# Altium project Project.PrjPcb
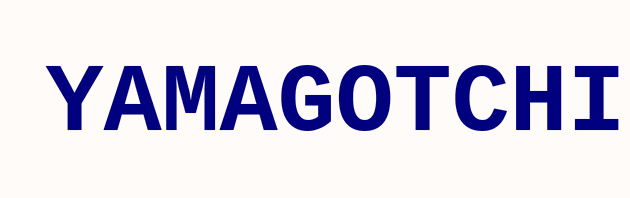
[diagram p0: p01_main.SchDoc]
9 sheets, 87 parts. Net scope: global (net labels, ports and power ports of the same name join across sheets).
Board file: board.PcbDoc
Sheets:
  p01_main.SchDoc
  p02_power.SchDoc
  p03_display.SchDoc
  p04_buttons.SchDoc
  p05_leds.SchDoc
  p06_sound.SchDoc
  p07_cpu_renesas_144.SchDoc
  p08_boot.SchDoc
  p09_memory.SchDoc

## Sheet p01_main.SchDoc
size A4

### Notes on the sheet
- YAMAGOTCHI

## Sheet p02_power.SchDoc
size A
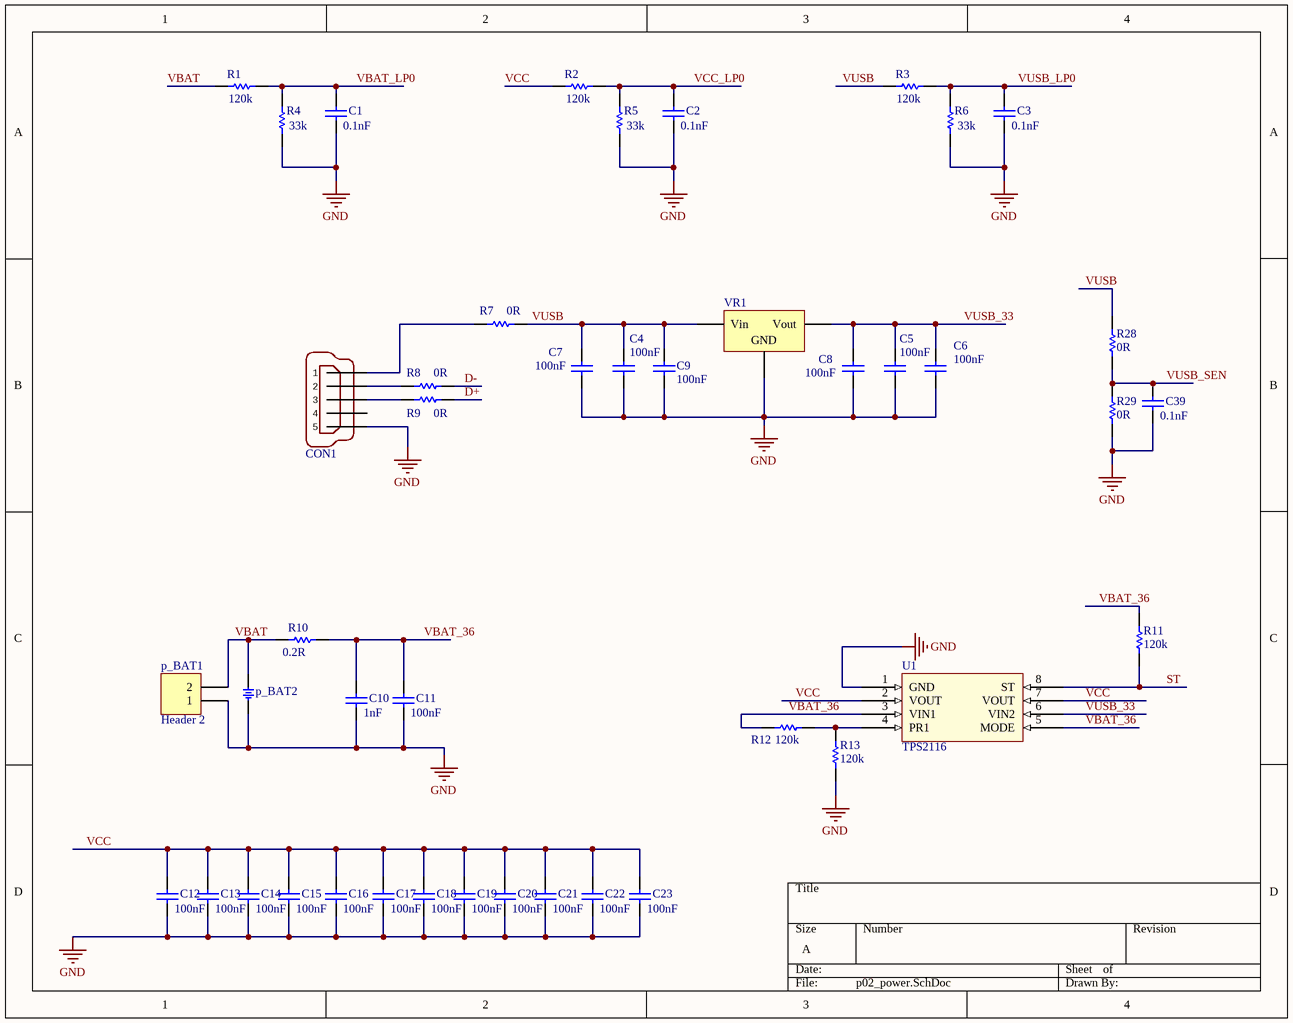
[diagram p1: p02_power.SchDoc]

### Parts
C1  value 0.1nF  [C0805]  (hidden comment: Cap)
C2  value 0.1nF  [C0805]  (hidden comment: Cap)
C3  value 0.1nF  [C0805]  (hidden comment: Cap)
C4  value 100nF  [C0805]  (hidden comment: Cap)
C5  value 100nF  [C0805]  (hidden comment: Cap)
C6  value 100nF  [C0805]  (hidden comment: Cap)
C7  value 100nF  [C0805]  (hidden comment: Cap)
C8  value 100nF  [C0805]  (hidden comment: Cap)
C9  value 100nF  [C0805]  (hidden comment: Cap)
C10  value 1nF  [C0805]  (hidden comment: Cap)
C11  value 100nF  [C0805]  (hidden comment: Cap)
C12  value 100nF  [C0805]  (hidden comment: Cap)
C13  value 100nF  [C0805]  (hidden comment: Cap)
C14  value 100nF  [C0805]  (hidden comment: Cap)
C15  value 100nF  [C0805]  (hidden comment: Cap)
C16  value 100nF  [C0805]  (hidden comment: Cap)
C17  value 100nF  [C0805]  (hidden comment: Cap)
C18  value 100nF  [C0805]  (hidden comment: Cap)
C19  value 100nF  [C0805]  (hidden comment: Cap)
C20  value 100nF  [C0805]  (hidden comment: Cap)
C21  value 100nF  [C0805]  (hidden comment: Cap)
C22  value 100nF  [C0805]  (hidden comment: Cap)
C23  value 100nF  [C0805]  (hidden comment: Cap)
C39  value 0.1nF  [C0805]  (hidden comment: Cap)
CON1  897-43-005-00-100001  [USB-MINI-B-5P-SMD]  (value not drawn)
p_BAT1  Header 2  [HDR1X2]
p_BAT2  (no value)  [BTH2032]
R1  value 120k  [6-0805_M]  (hidden comment: Res1)
R2  value 120k  [6-0805_M]  (hidden comment: Res1)
R3  value 120k  [6-0805_M]  (hidden comment: Res1)
R4  value 33k  [6-0805_M]  (hidden comment: Res1)
R5  value 33k  [6-0805_M]  (hidden comment: Res1)
R6  value 33k  [6-0805_M]  (hidden comment: Res1)
R7  0R  [6-0805_M]
R8  0R  [6-0805_M]
R9  0R  [6-0805_M]
R10  value 0.2R  [6-0805_M]  (hidden comment: Res1)
R11  value 120k  [6-0805_M]  (hidden comment: Res1)
R12  value 120k  [6-0805_M]  (hidden comment: Res1)
R13  value 120k  [6-0805_M]  (hidden comment: Res1)
R28  0R  [6-0805_M]
R29  0R  [6-0805_M]
U1  TPS2116  [SOIC127P600X175-8N]
VR1  Volt Reg  [D2PAK_N]  (value not drawn)

### Nets
GND: C1.2 C2.2 C3.2 C4.1 C5.1 C6.1 C7.1 C8.1 C9.1 C10.1 C11.1 C12.1 C13.1 C14.1 C15.1 C16.1 C17.1 C18.1 C19.1 C20.1 C21.1 C22.1 C23.1 C39.2 CON1.5 p_BAT1.1 p_BAT2.2 R4.2 R5.2 R6.2 R13.2 R29.2 U1.1(GND) VR1.2(GND)
D+: R9.1
D-: R8.1
ST: R11.2 U1.8(ST)
VBAT: p_BAT1.2 p_BAT2.1 R1.2 R10.2
VBAT_36: C10.2 C11.2 R10.1 R11.1 R12.1 U1.3(VIN1) U1.5(MODE)
VBAT_LP0: C1.1 R1.1 R4.1
VCC: C12.2 C13.2 C14.2 C15.2 C16.2 C17.2 C18.2 C19.2 C20.2 C21.2 C22.2 C23.2 R2.2 U1.2(VOUT) U1.7(VOUT)
VCC_LP0: C2.1 R2.1 R5.1
VUSB: C4.2 C7.2 C9.2 R3.2 R7.1 R28.1 VR1.1(Vin)
VUSB_33: C5.2 C6.2 C8.2 U1.6(VIN2) VR1.3(Vout)
VUSB_LP0: C3.1 R3.1 R6.1
VUSB_SEN: C39.1 R28.2 R29.1
NetCON1_1: CON1.1 R7.2
NetCON1_2: CON1.2 R8.2
NetCON1_3: CON1.3 R9.2
NetR12_2: R12.2 R13.1 U1.4(PR1)

Not connected (* = marked no-connect by the designer): CON1 4

### Library data of the parts
C1-C23 C39 = Cap: Capacitor; Published: 8-Jun-2000; LatestRevisionDate: 17-Jul-2002; LatestRevisionNote: Re-released for DXP Platform.; PackageReference: RAD-0.3; Publisher: Altium Limited; PackageDescription: Radial Cap, Thru-Hole; 2 Leads; 0.3 in Pin Spacing
CON1 = MINI-USB-32005-201: Connector,MiniUSB B port,5 position,Right Angle,Gold flash 30u,black,SMD; Manufacturer: MILL-MAX; Embest PN: 1009007100067; Value: 897-43-005-00-100001; Part Type: USB Connector; Manufacturer Part Number: 897-43-005-00-100001
p_BAT1 = Header 2: Header, 2-Pin; LatestRevisionDate: 17-Jul-2002; LatestRevisionNote: Re-released for DXP Platform.; Publisher: Altium Limited
p_BAT2 = BATH_CR2032: BATTERY HOLDER, CR2032; MANF_P#: -; .: http://www.chila.ir
R1-R6 R10-R13 = Res1: Resistor; Published: 8-Jun-2000; LatestRevisionDate: 17-Jul-2002; LatestRevisionNote: Re-released for DXP Platform.; PackageReference: AXIAL-0.3; Publisher: Altium Limited; PackageDescription: Axial Device, Thru-Hole; 2 Leads; 0.3 in Pin Spacing
R7-R9 R28 R29 = Res1: Resistor; Value: 0.2R; Published: 8-Jun-2000; LatestRevisionDate: 17-Jul-2002; LatestRevisionNote: Re-released for DXP Platform.; PackageReference: AXIAL-0.3; Publisher: Altium Limited; PackageDescription: Axial Device, Thru-Hole; 2 Leads; 0.3 in Pin Spacing
U1 = TPS2116: TPS2116 1.6 V to 5.5 V, 2.5-A Low IQ Power Mux with Manual and Priority Switchover
VR1 = Volt Reg: Voltage Regulator; Published: 24-Mar-1999; LatestRevisionDate: 29-May-2009; LatestRevisionNote: IPC-7351 Footprint Added.; PackageReference: D2PAK; Publisher: Altium Limited; PackageDescription: 3-Pin Transistor Outline Package 2.54 mm Pitch, 15.1 mm Lead Span

## Sheet p03_display.SchDoc
size A
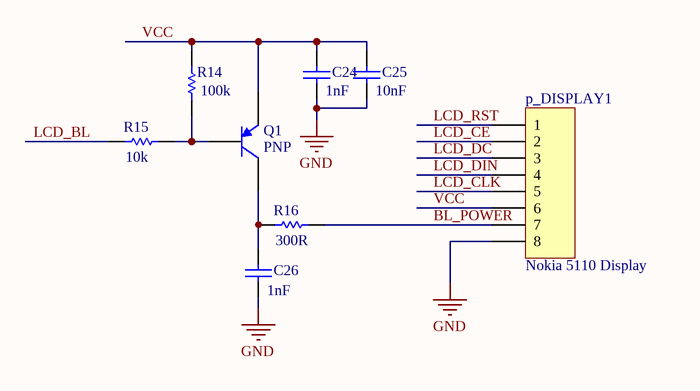
[diagram p2: p03_display.SchDoc]

### Parts
C24  value 1nF  [C0805]  (hidden comment: Cap)
C25  value 10nF  [C0805]  (hidden comment: Cap)
C26  value 1nF  [C0805]  (hidden comment: Cap)
p_DISPLAY1  Nokia 5110 Display  [HDR1X8]
Q1  PNP  [SOT-23B_N]
R14  value 100k  [6-0805_M]  (hidden comment: Res1)
R15  value 10k  [6-0805_M]  (hidden comment: Res1)
R16  value 300R  [6-0805_M]  (hidden comment: Res1)

### Nets
GND: C24.1 C25.1 C26.1 p_DISPLAY1.8
BL_POWER: p_DISPLAY1.7 R16.1
LCD_BL: R15.2
LCD_CE: p_DISPLAY1.2
LCD_CLK: p_DISPLAY1.5
LCD_DC: p_DISPLAY1.3
LCD_DIN: p_DISPLAY1.4
LCD_RST: p_DISPLAY1.1
VCC: C24.2 C25.2 p_DISPLAY1.6 Q1.3(E) R14.1
NetC26_2: C26.2 Q1.1(C) R16.2
NetQ1_2: Q1.2(B) R14.2 R15.1

### Library data of the parts
C24-C26 = Cap: Capacitor; Published: 8-Jun-2000; LatestRevisionDate: 17-Jul-2002; LatestRevisionNote: Re-released for DXP Platform.; PackageReference: RAD-0.3; Publisher: Altium Limited; PackageDescription: Radial Cap, Thru-Hole; 2 Leads; 0.3 in Pin Spacing
p_DISPLAY1 = Header 8: Header, 8-Pin; LatestRevisionDate: 17-Jul-2002; LatestRevisionNote: Re-released for DXP Platform.; Publisher: Altium Limited
Q1 = PNP: PNP Bipolar Transistor; Published: 8-Jun-2000; LatestRevisionDate: 29-May-2009; LatestRevisionNote: IPC-7351 Footprint Added.; PackageVersion: Aug-1999; PackageReference: SOT-23B; Publisher: Altium Limited; PackageDescription: 3-Pin SOT-23 Package 0.95 mm Pitch, 2.4 mm Lead Span
R14-R16 = Res1: Resistor; Published: 8-Jun-2000; LatestRevisionDate: 17-Jul-2002; LatestRevisionNote: Re-released for DXP Platform.; PackageReference: AXIAL-0.3; Publisher: Altium Limited; PackageDescription: Axial Device, Thru-Hole; 2 Leads; 0.3 in Pin Spacing

## Sheet p04_buttons.SchDoc
size A
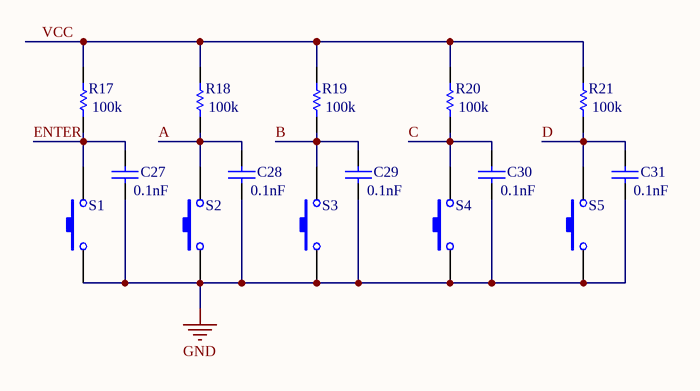
[diagram p3: p04_buttons.SchDoc]

### Parts
C27  value 0.1nF  [C0805]  (hidden comment: Cap)
C28  value 0.1nF  [C0805]  (hidden comment: Cap)
C29  value 0.1nF  [C0805]  (hidden comment: Cap)
C30  value 0.1nF  [C0805]  (hidden comment: Cap)
C31  value 0.1nF  [C0805]  (hidden comment: Cap)
R17  value 100k  [6-0805_M]  (hidden comment: Res1)
R18  value 100k  [6-0805_M]  (hidden comment: Res1)
R19  value 100k  [6-0805_M]  (hidden comment: Res1)
R20  value 100k  [6-0805_M]  (hidden comment: Res1)
R21  value 100k  [6-0805_M]  (hidden comment: Res1)
S1  SW-PB  [SPST-2]  (value not drawn)
S2  SW-PB  [SPST-2]  (value not drawn)
S3  SW-PB  [SPST-2]  (value not drawn)
S4  SW-PB  [SPST-2]  (value not drawn)
S5  SW-PB  [SPST-2]  (value not drawn)

### Nets
GND: C27.2 C28.2 C29.2 C30.2 C31.2 S1.1 S2.1 S3.1 S4.1 S5.1
A: C28.1 R18.2 S2.2
B: C29.1 R19.2 S3.2
C: C30.1 R20.2 S4.2
D: C31.1 R21.2 S5.2
ENTER: C27.1 R17.2 S1.2
VCC: R17.1 R18.1 R19.1 R20.1 R21.1

### Library data of the parts
C27-C31 = Cap: Capacitor; Published: 8-Jun-2000; LatestRevisionDate: 17-Jul-2002; LatestRevisionNote: Re-released for DXP Platform.; PackageReference: RAD-0.3; Publisher: Altium Limited; PackageDescription: Radial Cap, Thru-Hole; 2 Leads; 0.3 in Pin Spacing
R17-R21 = Res1: Resistor; Published: 8-Jun-2000; LatestRevisionDate: 17-Jul-2002; LatestRevisionNote: Re-released for DXP Platform.; PackageReference: AXIAL-0.3; Publisher: Altium Limited; PackageDescription: Axial Device, Thru-Hole; 2 Leads; 0.3 in Pin Spacing
S1-S5 = SW-PB: Switch; Published: 24-Mar-1999; LatestRevisionDate: 17-Jul-2002; LatestRevisionNote: Re-released for DXP Platform.; PackageReference: SPST-2; Publisher: Altium Limited; PackageDescription: Switch; 2 Leads

## Sheet p05_leds.SchDoc
size A
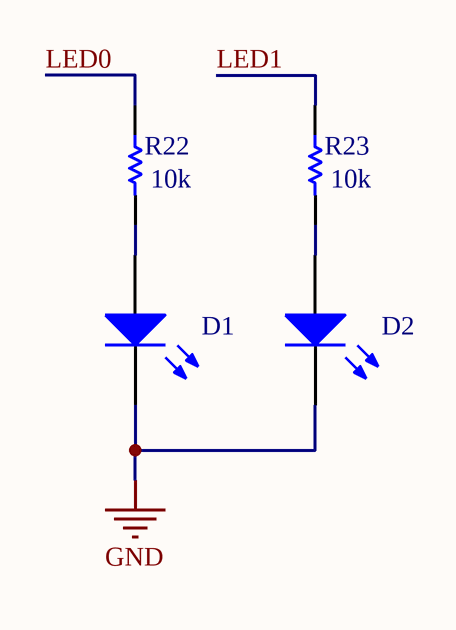
[diagram p4: p05_leds.SchDoc]

### Parts
D1  LED0  [6-0805_M]  (value not drawn)
D2  LED0  [6-0805_M]  (value not drawn)
R22  value 10k  [6-0805_M]  (hidden comment: Res1)
R23  value 10k  [6-0805_M]  (hidden comment: Res1)

### Nets
GND: D1.2(K) D2.2(K)
LED0: R22.1
LED1: R23.1
NetD1_1: D1.1(A) R22.2
NetD2_1: D2.1(A) R23.2

### Library data of the parts
D1 D2 = LED0: Typical INFRARED GaAs LED; Published: 8-Jun-2000; LatestRevisionDate: 08-Jul-2005; LatestRevisionNote: Mech Layer 1 removed.; PackageReference: LED-0; Publisher: Altium Limited; PackageDescription: LED; 2 Leads
R22 R23 = Res1: Resistor; Published: 8-Jun-2000; LatestRevisionDate: 17-Jul-2002; LatestRevisionNote: Re-released for DXP Platform.; PackageReference: AXIAL-0.3; Publisher: Altium Limited; PackageDescription: Axial Device, Thru-Hole; 2 Leads; 0.3 in Pin Spacing

## Sheet p06_sound.SchDoc
size A
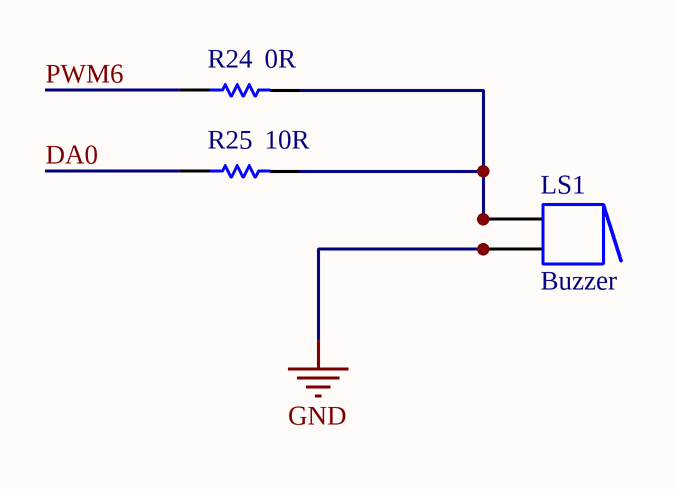
[diagram p5: p06_sound.SchDoc]

### Parts
LS1  Buzzer  [HDR1X2]
R24  value 0R  [6-0805_M]  (hidden comment: Res1)
R25  value 10R  [6-0805_M]  (hidden comment: Res1)

### Nets
GND: LS1.2 LS1.2A
DA0: R25.1
PWM6: R24.1
NetLS1_1: LS1.1 LS1.1A R24.2 R25.2

### Library data of the parts
LS1 = Buzzer: Magnetic Transducer Buzzer; Published: 24-Mar-1999; LatestRevisionDate: 17-Dec-2003; LatestRevisionNote: Schematic revised, PCB Footprint replaced.; DatasheetVersion: 17-Dec-2003; PackageReference: ABSM-1574; Publisher: Altium Limited; PackageDescription: Magnetic Transducer Buzzer; ComponentLink1Description: Manufacturer Link; ComponentLink1URL: http://www.megastar.com/linecard/buzzmode/index.php
R24 R25 = Res1: Resistor; Published: 8-Jun-2000; LatestRevisionDate: 17-Jul-2002; LatestRevisionNote: Re-released for DXP Platform.; PackageReference: AXIAL-0.3; Publisher: Altium Limited; PackageDescription: Axial Device, Thru-Hole; 2 Leads; 0.3 in Pin Spacing

## Sheet p07_cpu_renesas_144.SchDoc
size A3
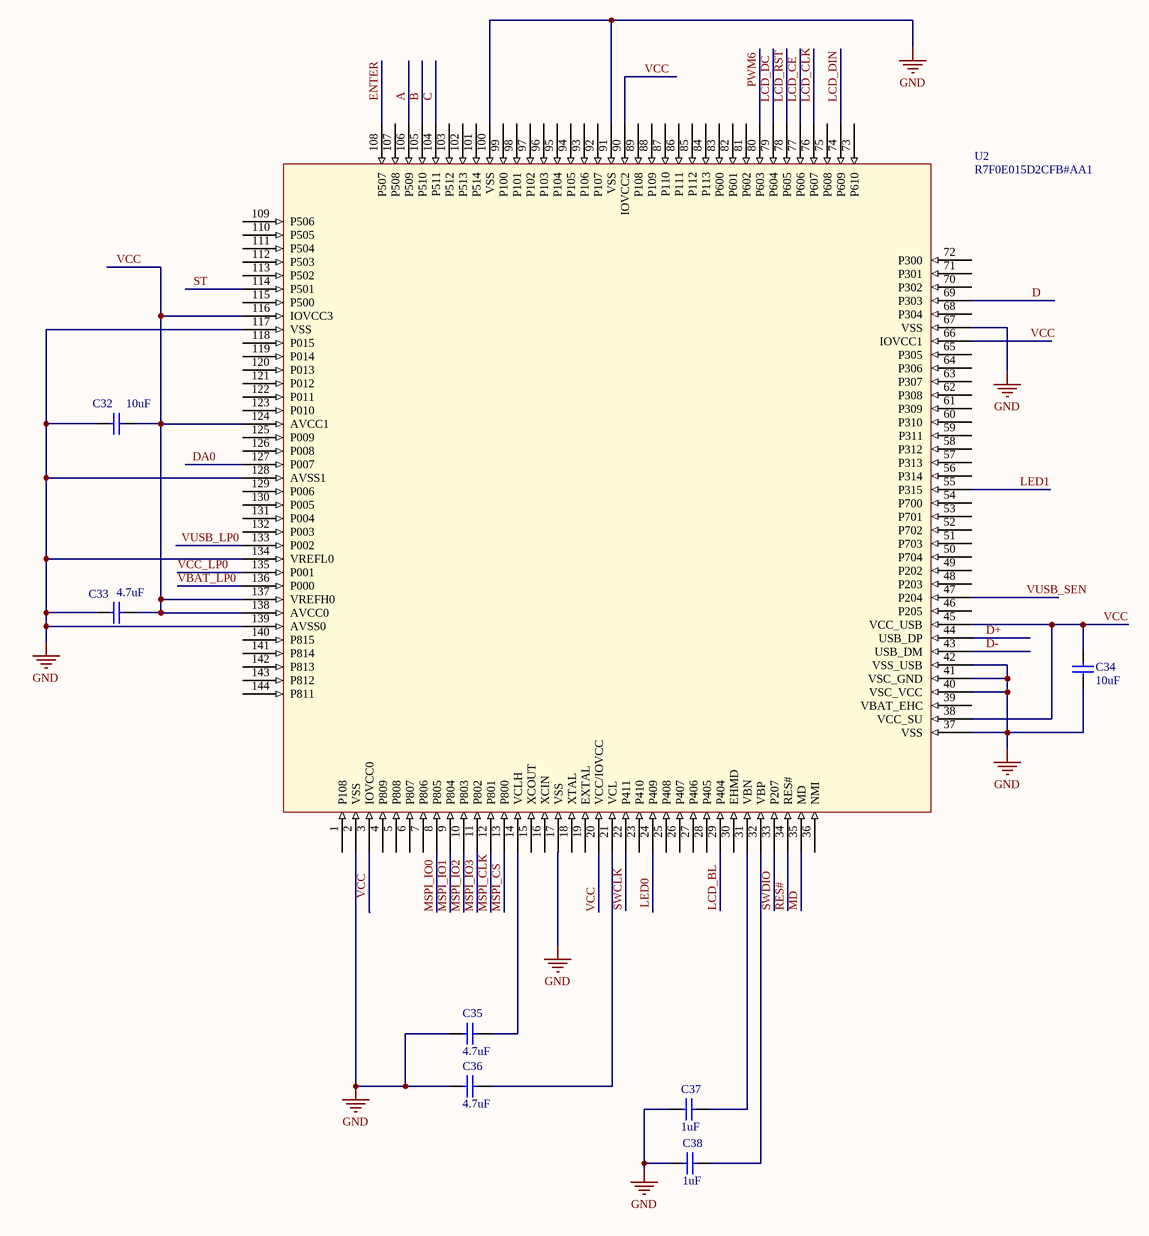
[diagram p6: p07_cpu_renesas_144.SchDoc]

### Parts
C32  value 10uF  [C1206]  (hidden comment: Cap)
C33  value 4.7uF  [C1206]  (hidden comment: Cap)
C34  value 10uF  [C1206]  (hidden comment: Cap)
C35  value 4.7uF  [C1206]  (hidden comment: Cap)
C36  value 4.7uF  [C1206]  (hidden comment: Cap)
C37  value 1uF  [C0805]  (hidden comment: Cap)
C38  value 1uF  [C0805]  (hidden comment: Cap)
U2  R7F0E015D2CFB#AA1  [SQFP50P2200X2200X170-144N]

### Nets
GND: C32.2 C33.2 C34.1 C35.2 C36.2 C37.1 C38.1 U2.2(VSS) U2.17(VSS) U2.37(VSS) U2.40(VSC_VCC) U2.41(VSC_GND) U2.42(VSS_USB) U2.67(VSS) U2.91(VSS) U2.100(VSS) U2.117(VSS) U2.128(AVSS1) U2.134(VREFL0) U2.139(AVSS0)
A: U2.106(P509)
B: U2.105(P510)
C: U2.104(P511)
D: U2.69(P303)
D+: U2.44(USB_DP)
D-: U2.43(USB_DM)
DA0: U2.127(P007)
ENTER: U2.108(P507)
LCD_BL: U2.29(P404)
LCD_CE: U2.77(P606)
LCD_CLK: U2.76(P607)
LCD_DC: U2.79(P604)
LCD_DIN: U2.74(P609)
LCD_RST: U2.78(P605)
LED0: U2.24(P409)
LED1: U2.55(P315)
MD: U2.35(MD)
MSPI_CLK: U2.12(P801)
MSPI_CS: U2.13(P800)
MSPI_IO0: U2.8(P805)
MSPI_IO1: U2.9(P804)
MSPI_IO2: U2.10(P803)
MSPI_IO3: U2.11(P802)
PWM6: U2.80(P603)
RES#: U2.34(RES#)
ST: U2.114(P501)
SWCLK: U2.22(P411)
SWDIO: U2.33(P207)
VBAT_LP0: U2.136(P000)
VCC: C32.1 C33.1 C34.2 U2.3(IOVCC0) U2.20(VCC/IOVCC) U2.38(VCC_SU) U2.45(VCC_USB) U2.66(IOVCC1) U2.90(IOVCC2) U2.116(IOVCC3) U2.124(AVCC1) U2.137(VREFH0) U2.138(AVCC0)
VCC_LP0: U2.135(P001)
VUSB_LP0: U2.133(P002)
VUSB_SEN: U2.47(P204)
NetC35_1: C35.1 U2.14(VCLH)
NetC36_1: C36.1 U2.21(VCL)
NetC37_2: C37.2 U2.31(VBN)
NetC38_2: C38.2 U2.32(VBP)

Not connected (* = marked no-connect by the designer): U2 1(P108) 4(P809) 5(P808) 6(P807) 7(P806) 15(XCOUT) 16(XCIN) 18(XTAL) 19(EXTAL) 23(P410) 25(P408) 26(P407) 27(P406) 28(P405) 30(EHMD) 36(NMI) 39(VBAT_EHC) 46(P205) 48(P203) 49(P202) 50(P704) 51(P703) 52(P702) 53(P701) 54(P700) 56(P314) 57(P313) 58(P312) 59(P311) 60(P310) 61(P309) 62(P308) 63(P307) 64(P306) 65(P305) 68(P304) 70(P302) 71(P301) 72(P300) 73(P610) 75(P608) 81(P602) 82(P601) 83(P600) 84(P113) 85(P112) 86(P111) 87(P110) 88(P109) 89(P108) 92(P107) 93(P106) 94(P105) 95(P104) 96(P103) 97(P102) 98(P101) 99(P100) 101(P514) 102(P513) 103(P512) 107(P508) 109(P506) 110(P505) 111(P504) 112(P503) 113(P502) 115(P500) 118(P015) 119(P014) 120(P013) 121(P012) 122(P011) 123(P010) 125(P009) 126(P008) 129(P006) 130(P005) 131(P004) 132(P003) 140(P815) 141(P814) 142(P813) 143(P812) 144(P811)

### Library data of the parts
C32-C38 = Cap: Capacitor; Published: 8-Jun-2000; LatestRevisionDate: 17-Jul-2002; LatestRevisionNote: Re-released for DXP Platform.; PackageReference: RAD-0.3; Publisher: Altium Limited; PackageDescription: Radial Cap, Thru-Hole; 2 Leads; 0.3 in Pin Spacing
U2 = R7F0E015D2CFB#AA1: ARM® Cortex®-M0+ series Microcontroller IC 32-Bit 24MHz 1.5MB (1.5M x 8) FLASH 144-LFQFP (20x20)

## Sheet p08_boot.SchDoc
size A
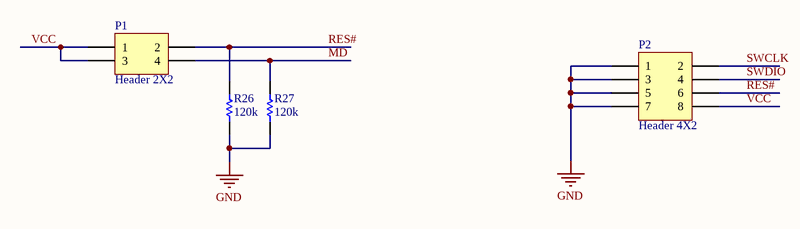
[diagram p7: p08_boot.SchDoc]

### Parts
P1  Header 2X2  [HDR2X2]
P2  Header 4X2  [HDR2X4]
R26  value 120k  [6-0805_M]  (hidden comment: Res1)
R27  value 120k  [6-0805_M]  (hidden comment: Res1)

### Nets
GND: P2.1 P2.3 P2.5 P2.7 R26.2 R27.2
MD: P1.4 R27.1
RES#: P1.2 P2.6 R26.1
SWCLK: P2.2
SWDIO: P2.4
VCC: P1.1 P1.3 P2.8

### Library data of the parts
P1 = Header 2X2: Header, 2-Pin, Dual row; LatestRevisionDate: 17-Jul-2002; LatestRevisionNote: Re-released for DXP Platform.; Publisher: Altium Limited
P2 = Header 4X2: Header, 4-Pin, Dual row; LatestRevisionDate: 17-Jul-2002; LatestRevisionNote: Re-released for DXP Platform.; Publisher: Altium Limited
R26 R27 = Res1: Resistor; Published: 8-Jun-2000; LatestRevisionDate: 17-Jul-2002; LatestRevisionNote: Re-released for DXP Platform.; PackageReference: AXIAL-0.3; Publisher: Altium Limited; PackageDescription: Axial Device, Thru-Hole; 2 Leads; 0.3 in Pin Spacing

## Sheet p09_memory.SchDoc
size A
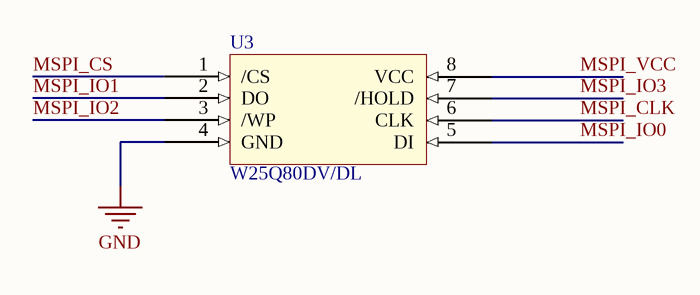
[diagram p8: p09_memory.SchDoc]

### Parts
U3  W25Q80DV/DL  [SOIC127P600X175-8N]

### Nets
GND: U3.4(GND)
MSPI_CLK: U3.6(CLK)
MSPI_CS: U3.1(/CS)
MSPI_IO0: U3.5(DI)
MSPI_IO1: U3.2(DO)
MSPI_IO2: U3.3(/WP)
MSPI_IO3: U3.7(/HOLD)
MSPI_VCC: U3.8(VCC)

### Library data of the parts
U3 = W25Q80DV/DL: 2.5V AND 3V 8M-BIT  SERIAL FLASH MEMORY WITH  DUAL AND QUAD SPI

## Nets that join several sheets
GND: p02_power (34 pins), p03_display (C24.1 C25.1 C26.1 p_DISPLAY1.8), p04_buttons (10 pins), p05_leds (D1.2 D2.2), p06_sound (LS1.2 LS1.2A), p07_cpu_renesas_144 (20 pins), p08_boot (6 pins), p09_memory (U3.4)
A: p04_buttons (C28.1 R18.2 S2.2), p07_cpu_renesas_144 (U2.106)
B: p04_buttons (C29.1 R19.2 S3.2), p07_cpu_renesas_144 (U2.105)
C: p04_buttons (C30.1 R20.2 S4.2), p07_cpu_renesas_144 (U2.104)
D: p04_buttons (C31.1 R21.2 S5.2), p07_cpu_renesas_144 (U2.69)
D+: p02_power (R9.1), p07_cpu_renesas_144 (U2.44)
D-: p02_power (R8.1), p07_cpu_renesas_144 (U2.43)
DA0: p06_sound (R25.1), p07_cpu_renesas_144 (U2.127)
ENTER: p04_buttons (C27.1 R17.2 S1.2), p07_cpu_renesas_144 (U2.108)
LCD_BL: p03_display (R15.2), p07_cpu_renesas_144 (U2.29)
LCD_CE: p03_display (p_DISPLAY1.2), p07_cpu_renesas_144 (U2.77)
LCD_CLK: p03_display (p_DISPLAY1.5), p07_cpu_renesas_144 (U2.76)
LCD_DC: p03_display (p_DISPLAY1.3), p07_cpu_renesas_144 (U2.79)
LCD_DIN: p03_display (p_DISPLAY1.4), p07_cpu_renesas_144 (U2.74)
LCD_RST: p03_display (p_DISPLAY1.1), p07_cpu_renesas_144 (U2.78)
LED0: p05_leds (R22.1), p07_cpu_renesas_144 (U2.24)
LED1: p05_leds (R23.1), p07_cpu_renesas_144 (U2.55)
MD: p07_cpu_renesas_144 (U2.35), p08_boot (P1.4 R27.1)
MSPI_CLK: p07_cpu_renesas_144 (U2.12), p09_memory (U3.6)
MSPI_CS: p07_cpu_renesas_144 (U2.13), p09_memory (U3.1)
MSPI_IO0: p07_cpu_renesas_144 (U2.8), p09_memory (U3.5)
MSPI_IO1: p07_cpu_renesas_144 (U2.9), p09_memory (U3.2)
MSPI_IO2: p07_cpu_renesas_144 (U2.10), p09_memory (U3.3)
MSPI_IO3: p07_cpu_renesas_144 (U2.11), p09_memory (U3.7)
PWM6: p06_sound (R24.1), p07_cpu_renesas_144 (U2.80)
RES#: p07_cpu_renesas_144 (U2.34), p08_boot (P1.2 P2.6 R26.1)
ST: p02_power (R11.2 U1.8), p07_cpu_renesas_144 (U2.114)
SWCLK: p07_cpu_renesas_144 (U2.22), p08_boot (P2.2)
SWDIO: p07_cpu_renesas_144 (U2.33), p08_boot (P2.4)
VBAT_LP0: p02_power (C1.1 R1.1 R4.1), p07_cpu_renesas_144 (U2.136)
VCC: p02_power (15 pins), p03_display (5 pins), p04_buttons (5 pins), p07_cpu_renesas_144 (13 pins), p08_boot (P1.1 P1.3 P2.8)
VCC_LP0: p02_power (C2.1 R2.1 R5.1), p07_cpu_renesas_144 (U2.135)
VUSB_LP0: p02_power (C3.1 R3.1 R6.1), p07_cpu_renesas_144 (U2.133)
VUSB_SEN: p02_power (C39.1 R28.2 R29.1), p07_cpu_renesas_144 (U2.47)